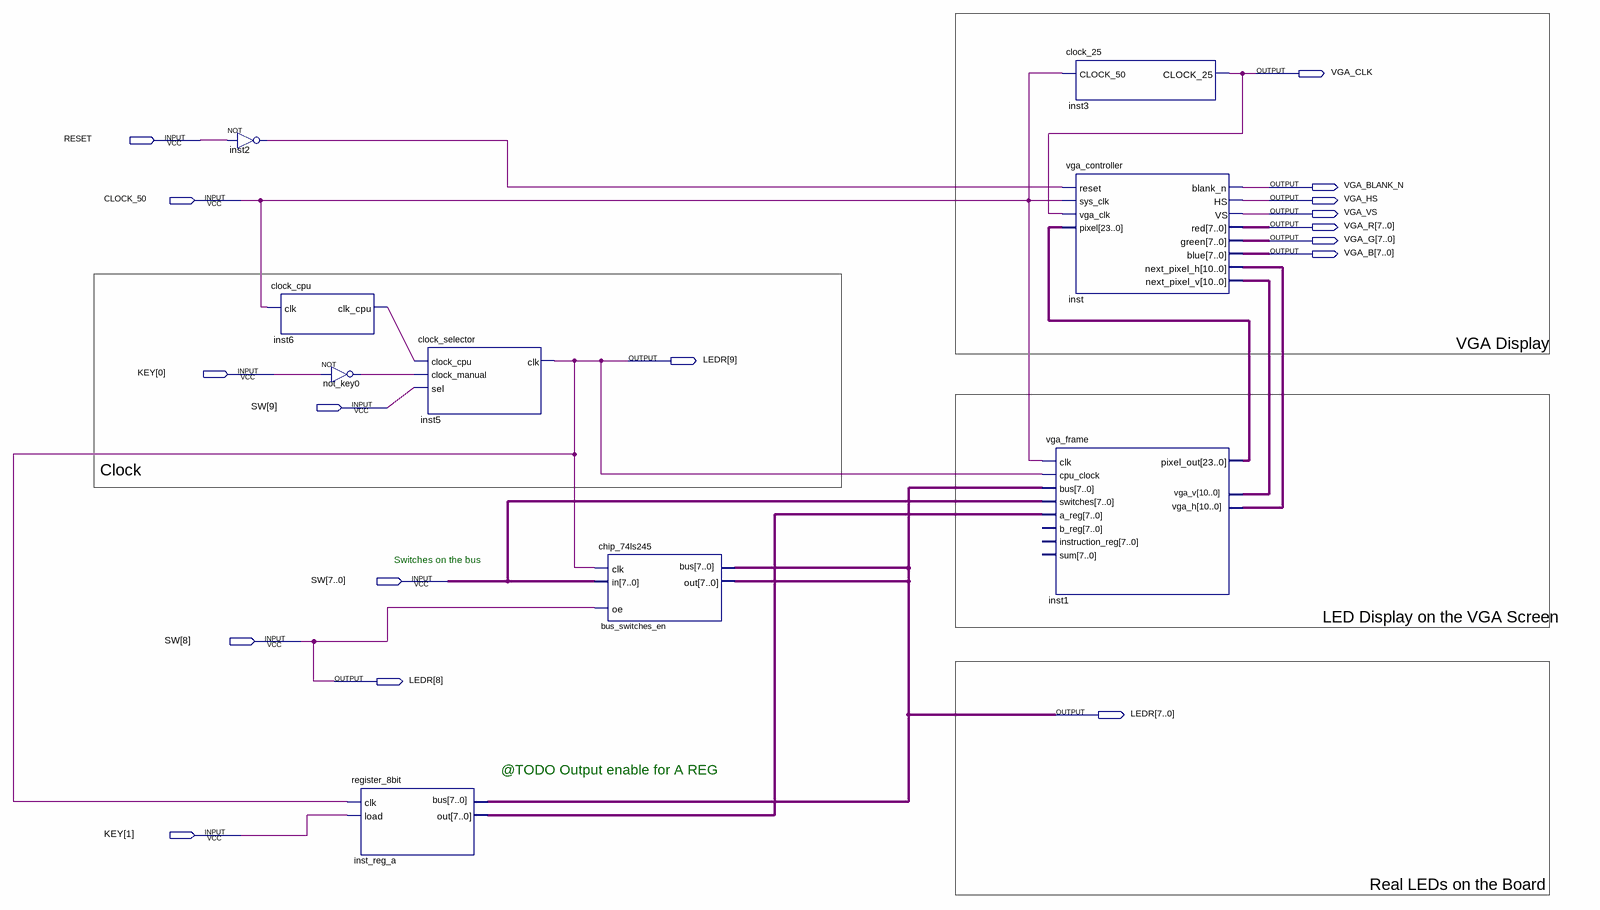
[diagram p0: schematic sheet]
// Quartus schematic project.bdf as structural Verilog: 9 symbols, 17 pins
module project (
  input  RESET,
  input  CLOCK_50,
  input  [1:0] KEY,
  input  [9:0] SW,
  output VGA_CLK,
  output VGA_BLANK_N,
  output VGA_HS,
  output VGA_VS,
  output [7:0] VGA_R,
  output [7:0] VGA_G,
  output [7:0] VGA_B,
  output [9:0] LEDR
);

  wire inst2_out, inst6_clk_cpu, not_key0_out;
  wire [7:0] inst_reg_a_out;
  wire [10:0] inst_next_pixel_h, inst_next_pixel_v;
  wire [23:0] inst1_pixel_out;

  not inst2 (inst2_out, RESET);
  clock_cpu inst6 (.clk(CLOCK_50), .clk_cpu(inst6_clk_cpu));
  not not_key0 (not_key0_out, KEY[0]);
  register_8bit inst_reg_a (.clk(LEDR[9]), .load(KEY[1]), .bus(LEDR[7:0]), .out(inst_reg_a_out));
  clock_selector inst5 (.clock_cpu(inst6_clk_cpu), .clock_manual(not_key0_out), .sel(SW[9]), .clk(LEDR[9]));
  chip_74ls245 bus_switches_en (.clk(LEDR[9]), .in(SW[7:0]), .bus(LEDR[7:0]), .oe(SW[8]), .out(LEDR[7:0]));
  clock_25 inst3 (.CLOCK_50(CLOCK_50), .CLOCK_25(VGA_CLK));
  vga_controller inst (
    .reset(inst2_out), .sys_clk(CLOCK_50), .vga_clk(VGA_CLK), .pixel(inst1_pixel_out), .blank_n(VGA_BLANK_N),
    .HS(VGA_HS), .VS(VGA_VS), .red(VGA_R), .green(VGA_G), .blue(VGA_B), .next_pixel_h(inst_next_pixel_h),
    .next_pixel_v(inst_next_pixel_v));
  vga_frame inst1 (
    .clk(CLOCK_50), .cpu_clock(LEDR[9]), .bus(LEDR[7:0]), .switches(SW[7:0]), .a_reg(inst_reg_a_out),
    .vga_h(inst_next_pixel_h), .vga_v(inst_next_pixel_v), .pixel_out(inst1_pixel_out));  // open: b_reg, instruction_reg, sum

  assign LEDR[8] = SW[8];

  // Notes on the sheet:
  //   VGA Display
  //   Clock
  //   Switches on the bus
  //   LED Display on the VGA Screen
  //   @TODO Output enable for A REG
  //   Real LEDs on the Board
endmodule
